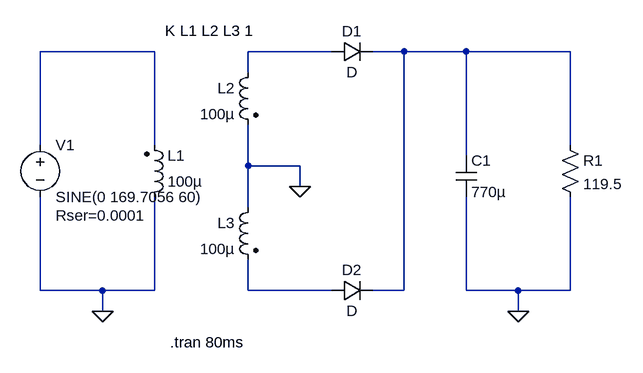
[diagram p0: schematic 2diode-120VAC-60Hz-770uF-119.5Ohm.asc]
2diode-120VAC-60Hz-770uF-119.5Ohm.asc, the LTspice schematic file:
Version 4
SHEET 1 880 680
WIRE 112 -32 -64 -32
WIRE 384 -32 256 -32
WIRE 496 -32 448 -32
WIRE 592 -32 496 -32
WIRE 752 -32 592 -32
WIRE 256 0 256 -32
WIRE -64 112 -64 -32
WIRE 112 112 112 -32
WIRE 752 112 752 -32
WIRE 592 128 592 -32
WIRE 256 144 256 80
WIRE 336 144 256 144
WIRE 336 176 336 144
WIRE 256 208 256 144
WIRE -64 336 -64 192
WIRE 32 336 -64 336
WIRE 112 336 112 192
WIRE 112 336 32 336
WIRE 256 336 256 288
WIRE 384 336 256 336
WIRE 496 336 496 -32
WIRE 496 336 448 336
WIRE 592 336 592 192
WIRE 672 336 592 336
WIRE 752 336 752 192
WIRE 752 336 672 336
WIRE 32 368 32 336
WIRE 672 368 672 336
FLAG 672 368 0
FLAG 336 176 0
FLAG 32 368 0
SYMBOL ind2 96 208 M180
WINDOW 0 36 80 Left 2
WINDOW 3 36 40 Left 2
SYMATTR InstName L1
SYMATTR Value 100µ
SYMATTR Type ind
SYMBOL ind2 272 -16 M0
SYMATTR InstName L2
SYMATTR Value 100µ
SYMATTR Type ind
SYMBOL ind2 272 192 M0
SYMATTR InstName L3
SYMATTR Value 100µ
SYMATTR Type ind
SYMBOL voltage -64 96 R0
WINDOW 123 0 0 Left 2
WINDOW 39 24 124 Left 2
SYMATTR InstName V1
SYMATTR Value SINE(0 169.7056 60)
SYMATTR SpiceLine Rser=0.0001
SYMBOL diode 384 -16 R270
WINDOW 0 32 32 VTop 2
WINDOW 3 0 32 VBottom 2
SYMATTR InstName D1
SYMBOL diode 384 352 R270
WINDOW 0 32 32 VTop 2
WINDOW 3 0 32 VBottom 2
SYMATTR InstName D2
SYMBOL cap 576 128 R0
SYMATTR InstName C1
SYMATTR Value 770µ
SYMBOL res 736 96 R0
SYMATTR InstName R1
SYMATTR Value 119.5
TEXT 136 416 Left 2 !.tran 80ms
TEXT 128 -64 Left 2 !K L1 L2 L3 1

The netlist it stands for:
* 2diode-120VAC-60Hz-770uF-119.5Ohm.asc
L1 0 N001 100µ
L2 N002 0 100µ
L3 0 N004 100µ
V1 N001 0 SINE(0 169.7056 60) Rser=0.0001
D1 N002 N003 D
D2 N004 N003 D
C1 N003 0 770µ
R1 N003 0 119.5
.model D D
.lib standard.dio
.tran 80ms
K L1 L2 L3 1
.backanno
.end